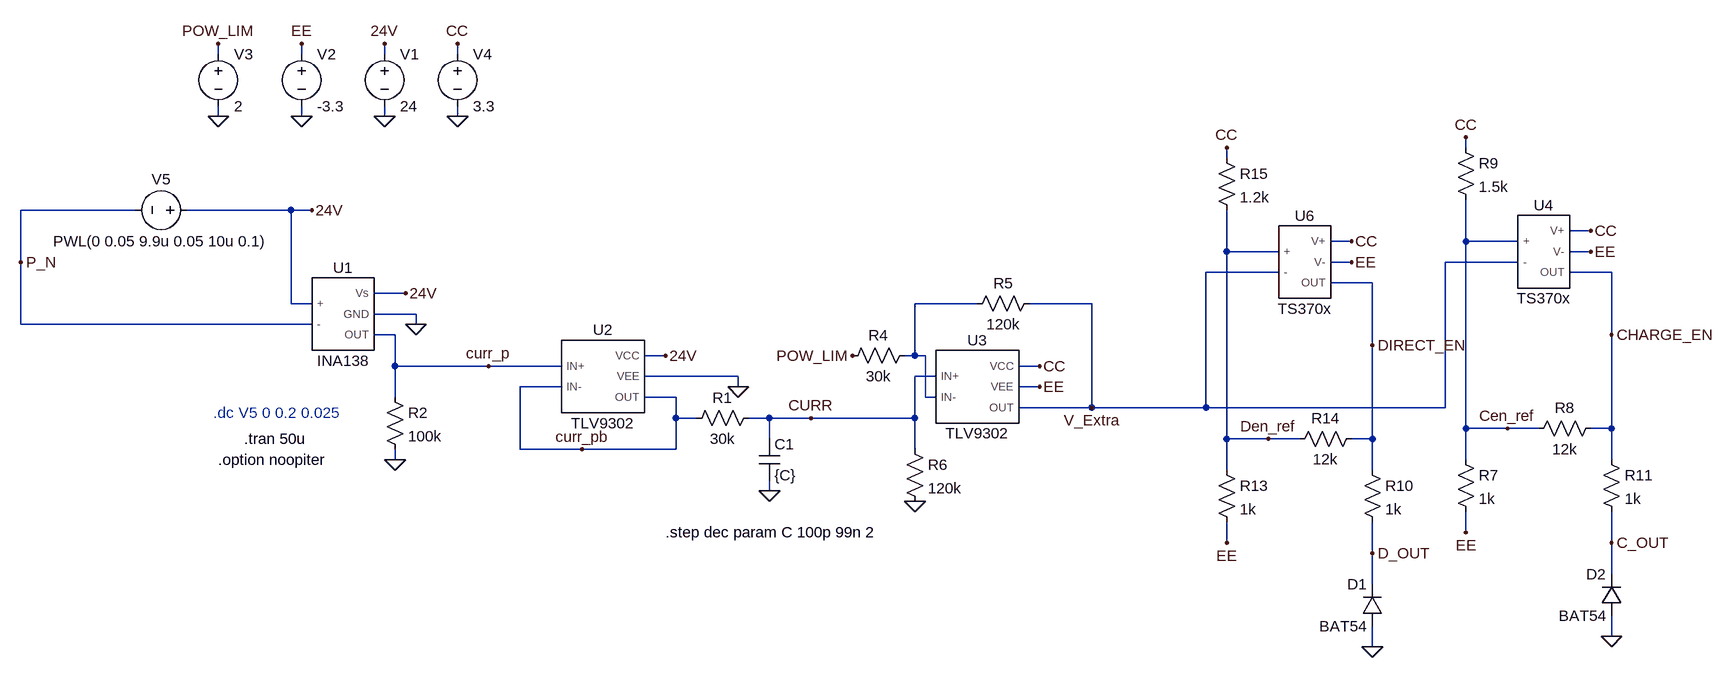
[diagram p0: schematic current_sense2.asc]
current_sense2.asc, the LTspice schematic file:
Version 4.1
SHEET 1 2352 680
WIRE 80 -304 80 -320
WIRE 208 -304 208 -320
WIRE 336 -304 336 -320
WIRE 448 -304 448 -320
WIRE 80 -208 80 -224
WIRE 208 -208 208 -224
WIRE 336 -208 336 -224
WIRE 448 -208 448 -224
WIRE 2000 -160 2000 -176
WIRE 1632 -144 1632 -160
WIRE -48 -64 -224 -64
WIRE 192 -64 32 -64
WIRE 224 -64 192 -64
WIRE 2192 -32 2160 -32
WIRE 1824 -16 1792 -16
WIRE 2000 -16 2000 -80
WIRE 2080 -16 2000 -16
WIRE 1632 0 1632 -64
WIRE 1712 0 1632 0
WIRE 2192 0 2160 0
WIRE -224 16 -224 -64
WIRE 1824 16 1792 16
WIRE 2080 16 1968 16
WIRE 1712 32 1600 32
WIRE 2224 32 2160 32
WIRE 1856 48 1792 48
WIRE 368 64 320 64
WIRE 192 80 192 -64
WIRE 224 80 192 80
WIRE 1248 80 1152 80
WIRE 1424 80 1328 80
WIRE 384 96 320 96
WIRE -224 112 -224 16
WIRE 224 112 -224 112
WIRE 384 112 384 96
WIRE 352 128 320 128
WIRE 2224 128 2224 32
WIRE 1856 144 1856 48
WIRE 768 160 736 160
WIRE 1152 160 1152 80
WIRE 1152 160 1136 160
WIRE 1168 160 1152 160
WIRE 352 176 352 128
WIRE 496 176 352 176
WIRE 608 176 496 176
WIRE 1344 176 1312 176
WIRE 880 192 736 192
WIRE 1184 192 1152 192
WIRE 608 208 544 208
WIRE 880 208 880 192
WIRE 1344 208 1312 208
WIRE 352 224 352 176
WIRE 784 224 736 224
WIRE 1168 224 1168 160
WIRE 1184 224 1168 224
WIRE 1424 240 1424 80
WIRE 1424 240 1312 240
WIRE 1600 240 1600 32
WIRE 1600 240 1424 240
WIRE 1968 240 1968 16
WIRE 1968 240 1600 240
WIRE 784 256 784 224
WIRE 816 256 784 256
WIRE 928 256 896 256
WIRE 992 256 928 256
WIRE 1152 256 1152 192
WIRE 1152 256 992 256
WIRE 2000 272 2000 -16
WIRE 2064 272 2000 272
WIRE 2112 272 2064 272
WIRE 2224 272 2224 128
WIRE 2224 272 2192 272
WIRE 928 288 928 256
WIRE 1632 288 1632 0
WIRE 1696 288 1632 288
WIRE 1744 288 1696 288
WIRE 1856 288 1856 144
WIRE 1856 288 1824 288
WIRE 544 304 544 208
WIRE 640 304 544 304
WIRE 784 304 784 256
WIRE 784 304 640 304
WIRE 1152 304 1152 256
WIRE 352 320 352 304
WIRE 2000 320 2000 272
WIRE 2224 320 2224 272
WIRE 1632 336 1632 288
WIRE 1856 336 1856 288
WIRE 928 368 928 352
WIRE 2000 432 2000 400
WIRE 1632 448 1632 416
WIRE 2224 448 2224 400
WIRE 1856 464 1856 416
WIRE 2224 496 2224 448
WIRE 1856 512 1856 464
WIRE 2224 592 2224 560
WIRE 1856 608 1856 576
FLAG 384 112 0
FLAG 352 320 0
FLAG 496 176 curr_p
FLAG 208 -208 0
FLAG 80 -208 0
FLAG 80 -320 POW_LIM
FLAG 448 -320 CC
FLAG 448 -208 0
FLAG 208 -320 EE
FLAG 336 -320 24V
FLAG 336 -208 0
FLAG -224 16 P_N
FLAG 928 368 0
FLAG 768 160 24V
FLAG 880 208 0
FLAG 640 304 curr_pb
FLAG 992 256 CURR
FLAG 1056 160 POW_LIM
FLAG 1424 240 V_Extra
FLAG 1152 384 0
FLAG 1344 176 CC
FLAG 1344 208 EE
FLAG 1856 144 DIRECT_EN
FLAG 1696 288 Den_ref
FLAG 1632 -160 CC
FLAG 1824 -16 CC
FLAG 1824 16 EE
FLAG 1632 448 EE
FLAG 2224 128 CHARGE_EN
FLAG 2064 272 Cen_ref
FLAG 2000 -176 CC
FLAG 2192 -32 CC
FLAG 2192 0 EE
FLAG 2000 432 EE
FLAG 1856 608 0
FLAG 1856 464 D_OUT
FLAG 2224 592 0
FLAG 2224 448 C_OUT
FLAG 224 -64 24V
FLAG 368 64 24V
SYMBOL res 336 208 R0
SYMATTR InstName R2
SYMATTR Value 100k
SYMATTR SpiceLine tol=5
SYMBOL INA138 272 96 R0
SYMATTR InstName U1
SYMBOL voltage 336 -320 R0
WINDOW 123 0 0 Left 0
WINDOW 39 0 0 Left 0
SYMATTR InstName V1
SYMATTR Value 24
SYMBOL voltage 208 -320 R0
WINDOW 123 0 0 Left 0
WINDOW 39 0 0 Left 0
SYMATTR InstName V2
SYMATTR Value -3.3
SYMBOL voltage 80 -320 R0
WINDOW 123 0 0 Left 0
WINDOW 39 0 0 Left 0
SYMATTR InstName V3
SYMATTR Value 2
SYMBOL voltage 448 -320 R0
SYMATTR InstName V4
SYMATTR Value 3.3
SYMBOL voltage 48 -64 R90
WINDOW 0 -32 56 VBottom 2
WINDOW 3 32 56 VTop 2
WINDOW 123 0 0 Left 0
WINDOW 39 0 0 Left 0
SYMATTR InstName V5
SYMATTR Value PWL(0 0.05 9.9u 0.05 10u 0.1)
SYMBOL res 912 240 R90
WINDOW 0 0 56 VBottom 2
WINDOW 3 32 56 VTop 2
SYMATTR InstName R1
SYMATTR Value 30k
SYMBOL TLV9302 672 192 R0
SYMATTR InstName U2
SYMBOL res 1152 144 R90
WINDOW 0 0 56 VBottom 2
WINDOW 3 32 56 VTop 2
SYMATTR InstName R4
SYMATTR Value 30k
SYMBOL res 1344 64 R90
WINDOW 0 0 56 VBottom 2
WINDOW 3 32 56 VTop 2
SYMATTR InstName R5
SYMATTR Value 120k
SYMBOL res 1136 288 R0
SYMATTR InstName R6
SYMATTR Value 120k
SYMBOL TLV9302 1248 208 R0
SYMATTR InstName U3
SYMBOL res 1616 320 R0
SYMATTR InstName R13
SYMATTR Value 1k
SYMATTR SpiceLine tol=5
SYMBOL res 1840 272 R90
WINDOW 0 0 56 VBottom 2
WINDOW 3 32 56 VTop 2
SYMATTR InstName R14
SYMATTR Value 12k
SYMATTR SpiceLine tol=5
SYMBOL res 1616 -160 R0
SYMATTR InstName R15
SYMATTR Value 1.2k
SYMATTR SpiceLine tol=2
SYMBOL TS370x 1744 16 R0
SYMATTR InstName U6
SYMBOL res 1984 304 R0
SYMATTR InstName R7
SYMATTR Value 1k
SYMATTR SpiceLine tol=5
SYMBOL res 2208 256 R90
WINDOW 0 0 56 VBottom 2
WINDOW 3 32 56 VTop 2
SYMATTR InstName R8
SYMATTR Value 12k
SYMATTR SpiceLine tol=5
SYMBOL res 1984 -176 R0
SYMATTR InstName R9
SYMATTR Value 1.5k
SYMATTR SpiceLine tol=2
SYMBOL TS370x 2112 0 R0
SYMATTR InstName U4
SYMBOL diode 1872 576 R180
WINDOW 0 24 64 Left 2
WINDOW 3 24 0 Left 2
SYMATTR InstName D1
SYMATTR Value BAT54
SYMBOL diode 2240 560 R180
WINDOW 0 24 64 Left 2
WINDOW 3 24 0 Left 2
SYMATTR InstName D2
SYMATTR Value BAT54
SYMBOL res 1840 320 R0
SYMATTR InstName R10
SYMATTR Value 1k
SYMBOL res 2208 304 R0
SYMATTR InstName R11
SYMATTR Value 1k
SYMBOL cap 912 288 R0
SYMATTR InstName C1
SYMATTR Value {C}
TEXT 72 248 Left 2 ;.dc V5 0 0.2 0.025
TEXT 120 288 Left 2 !.tran 50u
TEXT 80 320 Left 2 !.option noopiter
TEXT 768 432 Left 2 !.step dec param C 100p 99n 2

The netlist it stands for:
* current_sense2.asc
R2 curr_p 0 100k tol=5
X§U1 24V P_N 24V 0 curr_p INA138  ; pins + - Vs GND OUT
V1 24V 0 24
V2 EE 0 -3.3
V3 POW_LIM 0 2
V4 CC 0 3.3
V5 24V P_N PWL(0 0.05 9.9u 0.05 10u 0.1)
R1 CURR curr_pb 30k
X§U2 curr_p curr_pb 24V 0 curr_pb TLV9302  ; pins IN+ IN- VCC VEE OUT
R4 N001 POW_LIM 30k
R5 V_Extra N001 120k
R6 CURR 0 120k
X§U3 CURR N001 CC EE V_Extra TLV9302  ; pins IN+ IN- VCC VEE OUT
R13 Den_ref EE 1k tol=5
R14 DIRECT_EN Den_ref 12k tol=5
R15 CC Den_ref 1.2k tol=2
X§U6 Den_ref V_Extra CC EE DIRECT_EN TS370x  ; pins + - V+ V- OUT
R7 Cen_ref EE 1k tol=5
R8 CHARGE_EN Cen_ref 12k tol=5
R9 CC Cen_ref 1.5k tol=2
X§U4 Cen_ref V_Extra CC EE CHARGE_EN TS370x  ; pins + - V+ V- OUT
D1 0 D_OUT BAT54
D2 0 C_OUT BAT54
R10 DIRECT_EN D_OUT 1k
R11 CHARGE_EN C_OUT 1k
C1 CURR 0 {C}
.model D D
.lib standard.dio
* .dc V5 0 0.2 0.025
.tran 50u
.option noopiter
.step dec param C 100p 99n 2
.lib C:\Users\nithi\Downloads\sbom140a (2)\ina138.lib
.lib C:\Users\Tachi\Documents\robomaster_hardware\SupercapManager\SPICE_sims\libraries\tlv9302.lib
.lib ".\libraries\ts370x_spice.lib"
.backanno
.end